# Altium schematic sheet E22 FeatherWing.SchDoc: E22-900M22S FeatherWing
size A4; DrawnBy: Seamus O'Sullivan; Revision: 1.1
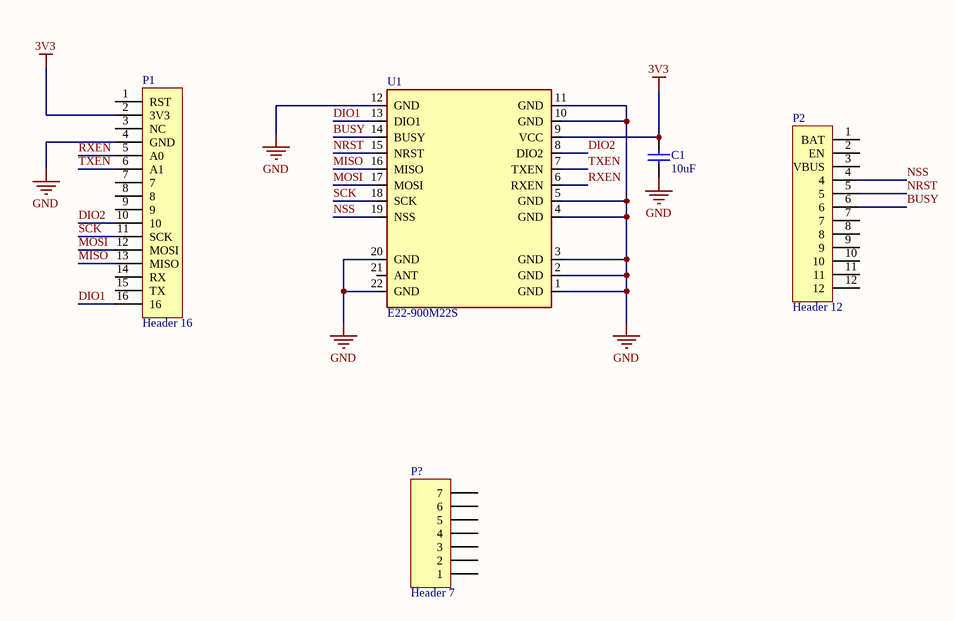
[diagram p0: E22 FeatherWing.SchDoc]

## Parts
C1  10uF  [CAPC2013X135X45ML10T25]
P1  Header 16  [HDR1X16]
P2  Header 12  [HDR1X12]
P?  Header 7  [HDR1X7]
U1  E22-900M22S  [WIRELM-SMD_E22-900M22S]

## Nets
3V3: C1.2 P1.2(3V3) U1.9(VCC)
GND: C1.1 P1.4(GND) U1.1(GND) U1.2(GND) U1.3(GND) U1.4(GND) U1.5(GND) U1.10(GND) U1.11(GND) U1.12(GND) U1.20(GND) U1.22(GND)
BUSY: P2.6 U1.14(BUSY)
DIO1: P1.16 U1.13(DIO1)
DIO2: P1.10 U1.8(DIO2)
MISO: P1.13(MISO) U1.16(MISO)
MOSI: P1.12(MOSI) U1.17(MOSI)
NRST: P2.5 U1.15(NRST)
NSS: P2.4 U1.19(NSS)
RXEN: P1.5(A0) U1.6(RXEN)
SCK: P1.11(SCK) U1.18(SCK)
TXEN: P1.6(A1) U1.7(TXEN)

Not connected (* = marked no-connect by the designer): P1 1(RST) 3(NC) 7 8 9 14(RX) 15(TX); P2 1(BAT) 2(EN) 3(VBUS) 7 8 9 10 11 12; P? 1 2 3 4 5 6 7; U1 21(ANT)

## Library data of the parts
C1 = CMP-2007-03541-1: Part Number: GRM21BR61E106KA73L; Manufacturer: Murata
P1 = Header 16: Header, 16-Pin; LatestRevisionDate: 17-Jul-2002; LatestRevisionNote: Re-released for DXP Platform.; Publisher: Altium Limited
P2 = Header 12: Header, 12-Pin; LatestRevisionDate: 17-Jul-2002; LatestRevisionNote: Re-released for DXP Platform.; Publisher: Altium Limited
P? = Header 7: Header, 7-Pin; LatestRevisionDate: 17-Jul-2002; LatestRevisionNote: Re-released for DXP Platform.; Publisher: Altium Limited
U1 = E22-900M22S: E22-900M22S From EByte